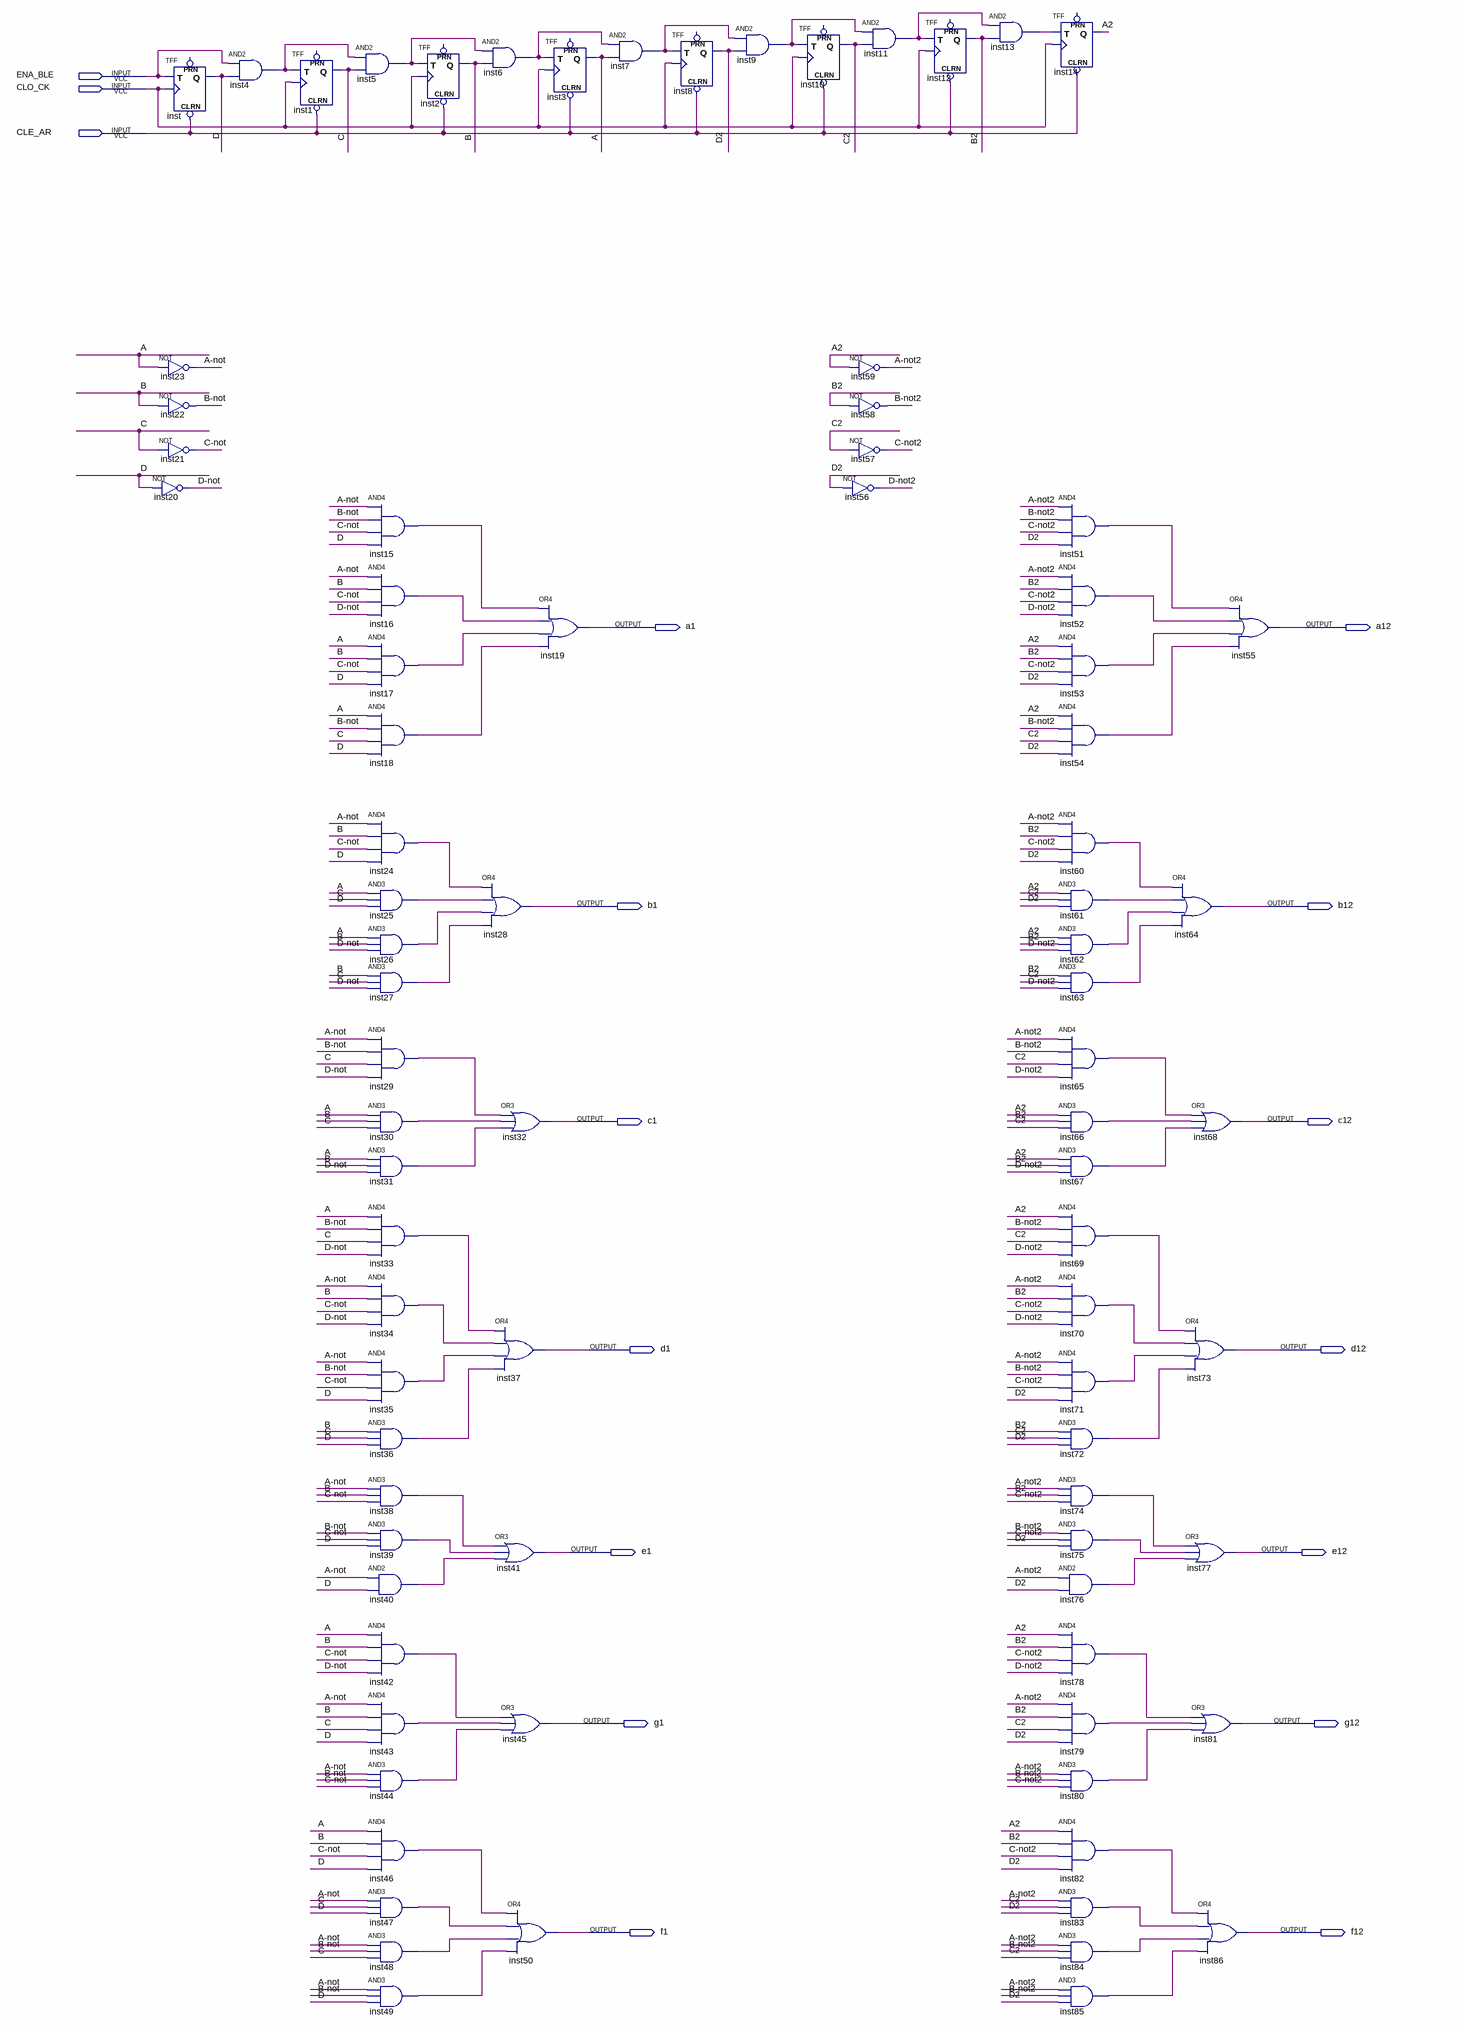
[diagram p0: schematic sheet]
// Quartus schematic contador8b.bdf as structural Verilog: 87 symbols, 17 pins
module contador8b (
  input  ENA_BLE,
  input  CLO_CK,
  input  CLE_AR,
  output a1,
  output a12,
  output b1,
  output b12,
  output c1,
  output c12,
  output d1,
  output d12,
  output e1,
  output e12,
  output g1,
  output g12,
  output f1,
  output f12
);

  wire A, A2, \A-not , \A-not2 , B, B2, \B-not , \B-not2 , C, C2, \C-not , \C-not2 , D, D2, \D-not ,
       \D-not2 , inst4_out, inst5_out, inst6_out, inst7_out, inst9_out, inst11_out, inst13_out, inst15_out,
       inst16_out, inst17_out, inst18_out, inst24_out, inst25_out, inst26_out, inst27_out, inst29_out,
       inst30_out, inst31_out, inst33_out, inst34_out, inst35_out, inst36_out, inst38_out, inst39_out,
       inst40_out, inst42_out, inst43_out, inst44_out, inst46_out, inst47_out, inst48_out, inst49_out,
       inst51_out, inst52_out, inst53_out, inst54_out, inst60_out, inst61_out, inst62_out, inst63_out,
       inst65_out, inst66_out, inst67_out, inst69_out, inst70_out, inst71_out, inst72_out, inst74_out,
       inst75_out, inst76_out, inst78_out, inst79_out, inst80_out, inst82_out, inst83_out, inst84_out,
       inst85_out;

  TFF inst (.CLRN(CLE_AR), .T(ENA_BLE), .CLK(CLO_CK), .Q(D));  // open: PRN
  not inst23 (\A-not , A);
  not inst22 (\B-not , B);
  not inst21 (\C-not , C);
  not inst20 (\D-not , D);
  and inst4 (inst4_out, ENA_BLE, D);
  TFF inst1 (.CLRN(CLE_AR), .T(inst4_out), .CLK(CLO_CK), .Q(C));  // open: PRN
  and inst5 (inst5_out, inst4_out, C);
  and inst15 (inst15_out, \A-not , \B-not , \C-not , D);
  and inst16 (inst16_out, \A-not , B, \C-not , \D-not );
  and inst17 (inst17_out, A, B, \C-not , D);
  and inst18 (inst18_out, A, \B-not , C, D);
  and inst24 (inst24_out, \A-not , B, \C-not , D);
  and inst25 (inst25_out, A, C, D);
  and inst26 (inst26_out, A, B, \D-not );
  and inst27 (inst27_out, B, C, \D-not );
  and inst29 (inst29_out, \A-not , \B-not , C, \D-not );
  and inst30 (inst30_out, A, B, C);
  and inst31 (inst31_out, A, B, \D-not );
  and inst33 (inst33_out, A, \B-not , C, \D-not );
  and inst34 (inst34_out, \A-not , B, \C-not , \D-not );
  and inst35 (inst35_out, \A-not , \B-not , \C-not , D);
  and inst36 (inst36_out, B, C, D);
  and inst38 (inst38_out, \A-not , B, \C-not );
  and inst39 (inst39_out, \B-not , \C-not , D);
  and inst40 (inst40_out, \A-not , D);
  and inst42 (inst42_out, A, B, \C-not , \D-not );
  and inst43 (inst43_out, \A-not , B, C, D);
  and inst44 (inst44_out, \A-not , \B-not , \C-not );
  and inst46 (inst46_out, A, B, \C-not , D);
  and inst47 (inst47_out, \A-not , C, D);
  and inst48 (inst48_out, \A-not , \B-not , C);
  and inst49 (inst49_out, \A-not , \B-not , D);
  TFF inst2 (.CLRN(CLE_AR), .T(inst5_out), .CLK(CLO_CK), .Q(B));  // open: PRN
  and inst6 (inst6_out, inst5_out, B);
  or inst28 (b1, inst24_out, inst25_out, inst26_out, inst27_out);
  or inst32 (c1, inst29_out, inst30_out, inst31_out);
  or inst37 (d1, inst33_out, inst34_out, inst35_out, inst36_out);
  or inst41 (e1, inst38_out, inst39_out, inst40_out);
  or inst45 (g1, inst42_out, inst43_out, inst44_out);
  or inst50 (f1, inst46_out, inst47_out, inst48_out, inst49_out);
  TFF inst3 (.CLRN(CLE_AR), .T(inst6_out), .CLK(CLO_CK), .Q(A));  // open: PRN
  or inst19 (a1, inst15_out, inst16_out, inst17_out, inst18_out);
  and inst7 (inst7_out, inst6_out, A);
  TFF inst8 (.CLRN(CLE_AR), .T(inst7_out), .CLK(CLO_CK), .Q(D2));  // open: PRN
  and inst9 (inst9_out, inst7_out, D2);
  TFF inst10 (.CLRN(CLE_AR), .T(inst9_out), .CLK(CLO_CK), .Q(C2));  // open: PRN
  and inst11 (inst11_out, inst9_out, C2);
  not inst59 (\A-not2 , A2);
  not inst58 (\B-not2 , B2);
  not inst57 (\C-not2 , C2);
  not inst56 (\D-not2 , D2);
  TFF inst12 (.CLRN(CLE_AR), .T(inst11_out), .CLK(CLO_CK), .Q(B2));  // open: PRN
  and inst13 (inst13_out, inst11_out, B2);
  TFF inst14 (.CLRN(CLE_AR), .T(inst13_out), .CLK(CLO_CK), .Q(A2));  // open: PRN
  and inst51 (inst51_out, \A-not2 , \B-not2 , \C-not2 , D2);
  and inst52 (inst52_out, \A-not2 , B2, \C-not2 , \D-not2 );
  and inst53 (inst53_out, A2, B2, \C-not2 , D2);
  and inst54 (inst54_out, A2, \B-not2 , C2, D2);
  and inst60 (inst60_out, \A-not2 , B2, \C-not2 , D2);
  and inst61 (inst61_out, A2, C2, D2);
  and inst62 (inst62_out, A2, B2, \D-not2 );
  and inst63 (inst63_out, B2, C2, \D-not2 );
  and inst65 (inst65_out, \A-not2 , \B-not2 , C2, \D-not2 );
  and inst66 (inst66_out, A2, B2, C2);
  and inst67 (inst67_out, A2, B2, \D-not2 );
  and inst69 (inst69_out, A2, \B-not2 , C2, \D-not2 );
  and inst70 (inst70_out, \A-not2 , B2, \C-not2 , \D-not2 );
  and inst71 (inst71_out, \A-not2 , \B-not2 , \C-not2 , D2);
  and inst72 (inst72_out, B2, C2, D2);
  and inst74 (inst74_out, \A-not2 , B2, \C-not2 );
  and inst75 (inst75_out, \B-not2 , \C-not2 , D2);
  and inst76 (inst76_out, \A-not2 , D2);
  and inst78 (inst78_out, A2, B2, \C-not2 , \D-not2 );
  and inst79 (inst79_out, \A-not2 , B2, C2, D2);
  and inst80 (inst80_out, \A-not2 , \B-not2 , \C-not2 );
  and inst82 (inst82_out, A2, B2, \C-not2 , D2);
  and inst83 (inst83_out, \A-not2 , C2, D2);
  and inst84 (inst84_out, \A-not2 , \B-not2 , C2);
  and inst85 (inst85_out, \A-not2 , \B-not2 , D2);
  or inst64 (b12, inst60_out, inst61_out, inst62_out, inst63_out);
  or inst55 (a12, inst51_out, inst52_out, inst53_out, inst54_out);
  or inst68 (c12, inst65_out, inst66_out, inst67_out);
  or inst73 (d12, inst69_out, inst70_out, inst71_out, inst72_out);
  or inst77 (e12, inst74_out, inst75_out, inst76_out);
  or inst81 (g12, inst78_out, inst79_out, inst80_out);
  or inst86 (f12, inst82_out, inst83_out, inst84_out, inst85_out);
endmodule
